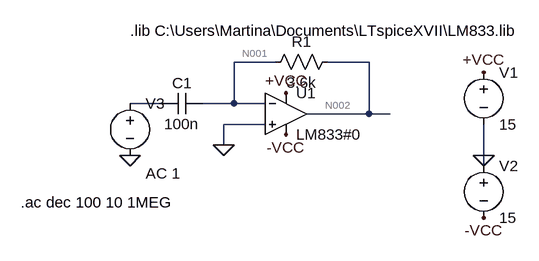
[diagram p0: schematic Draft2.asc]
Draft2.asc, the LTspice schematic file:
Version 4
SHEET 1 880 680
WIRE 160 64 96 64
WIRE 304 64 240 64
WIRE -16 128 -64 128
WIRE 96 128 96 64
WIRE 96 128 48 128
WIRE 144 128 96 128
WIRE 304 144 304 64
WIRE 304 144 208 144
WIRE 336 144 304 144
WIRE 144 160 80 160
WIRE 80 192 80 160
WIRE 480 208 480 160
WIRE 480 224 480 208
FLAG 80 192 0
FLAG -64 208 0
FLAG 176 112 +VCC
FLAG 480 80 +VCC
FLAG 480 304 -VCC
FLAG 176 176 -VCC
FLAG 480 208 0
SYMBOL Opamps\\opamp2 176 80 R0
SYMATTR InstName U1
SYMATTR Value LM833#0
SYMBOL res 256 48 R90
WINDOW 0 0 56 VBottom 2
WINDOW 3 32 56 VTop 2
SYMATTR InstName R1
SYMATTR Value 3.6k
SYMBOL cap 48 112 R90
WINDOW 0 0 32 VBottom 2
WINDOW 3 32 32 VTop 2
SYMATTR InstName C1
SYMATTR Value 100n
SYMBOL voltage 480 64 R0
SYMATTR InstName V1
SYMATTR Value 15
SYMBOL voltage 480 208 R0
SYMATTR InstName V2
SYMATTR Value 15
SYMBOL voltage -64 112 R0
WINDOW 123 24 124 Left 2
WINDOW 39 0 0 Left 2
SYMATTR InstName V3
SYMATTR Value ""
SYMATTR Value2 AC 1
TEXT -64 16 Left 2 !.lib C:\\Users\\Martina\\Documents\\LTspiceXVII\\LM833.lib
TEXT -232 280 Left 2 !.ac dec 100 10 1MEG

The netlist it stands for:
* Draft2.asc
XU1 0 N001 +VCC -VCC N002 LM833#0  ; pins In+ In- V+ V- OUT
R1 N002 N001 3.6k
C1 N001 N003 100n
V1 +VCC 0 15
V2 0 -VCC 15
V3 N003 0 AC 1
.lib C:\Users\Martina\Documents\LTspiceXVII\LM833.lib
.ac dec 100 10 1MEG
.backanno
.end

* Results of the author's LTspice run, read from the files saved beside the schematic
* Operating Point, zero values left out:
*   V(n002) = -1.086 mV
*   V(-vcc) = -15 V
*   V(+vcc) = 15 V
*   V(n001) = -6.421 µV
*   I(R1) = -300 nA
*   I(V2) = -1.103 mA
*   I(V1) = -1.104 mA
*   Ix(u1:1) = -300 nA
*   Ix(u1:2) = -300 nA
*   Ix(u1:3) = 1.104 mA
*   Ix(u1:4) = -1.103 mA
*   Ix(u1:5) = 300 nA
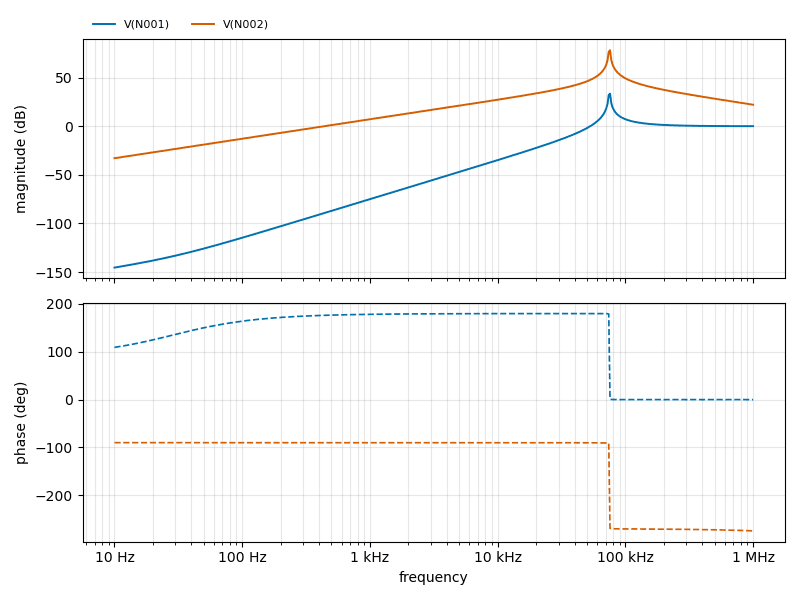
[diagram p1: AC Analysis of Draft2.asc, plotted from the saved traces]
* AC Analysis, 1 run:
*   V(N001): -145.37 dB at 10 Hz, 0.05 dB at 1 MHz, peak 33.57 dB at 75.86 kHz, 3 dB below the peak at 73.87 kHz and 76.39 kHz
*   V(N002): -32.91 dB at 10 Hz, 22.13 dB at 1 MHz, peak 78.07 dB at 75.86 kHz, 3 dB below the peak at 73.83 kHz and 76.38 kHz